# Altium schematic sheet IO.SchDoc
size C; SheetNumber: 7; SheetTotal: 7
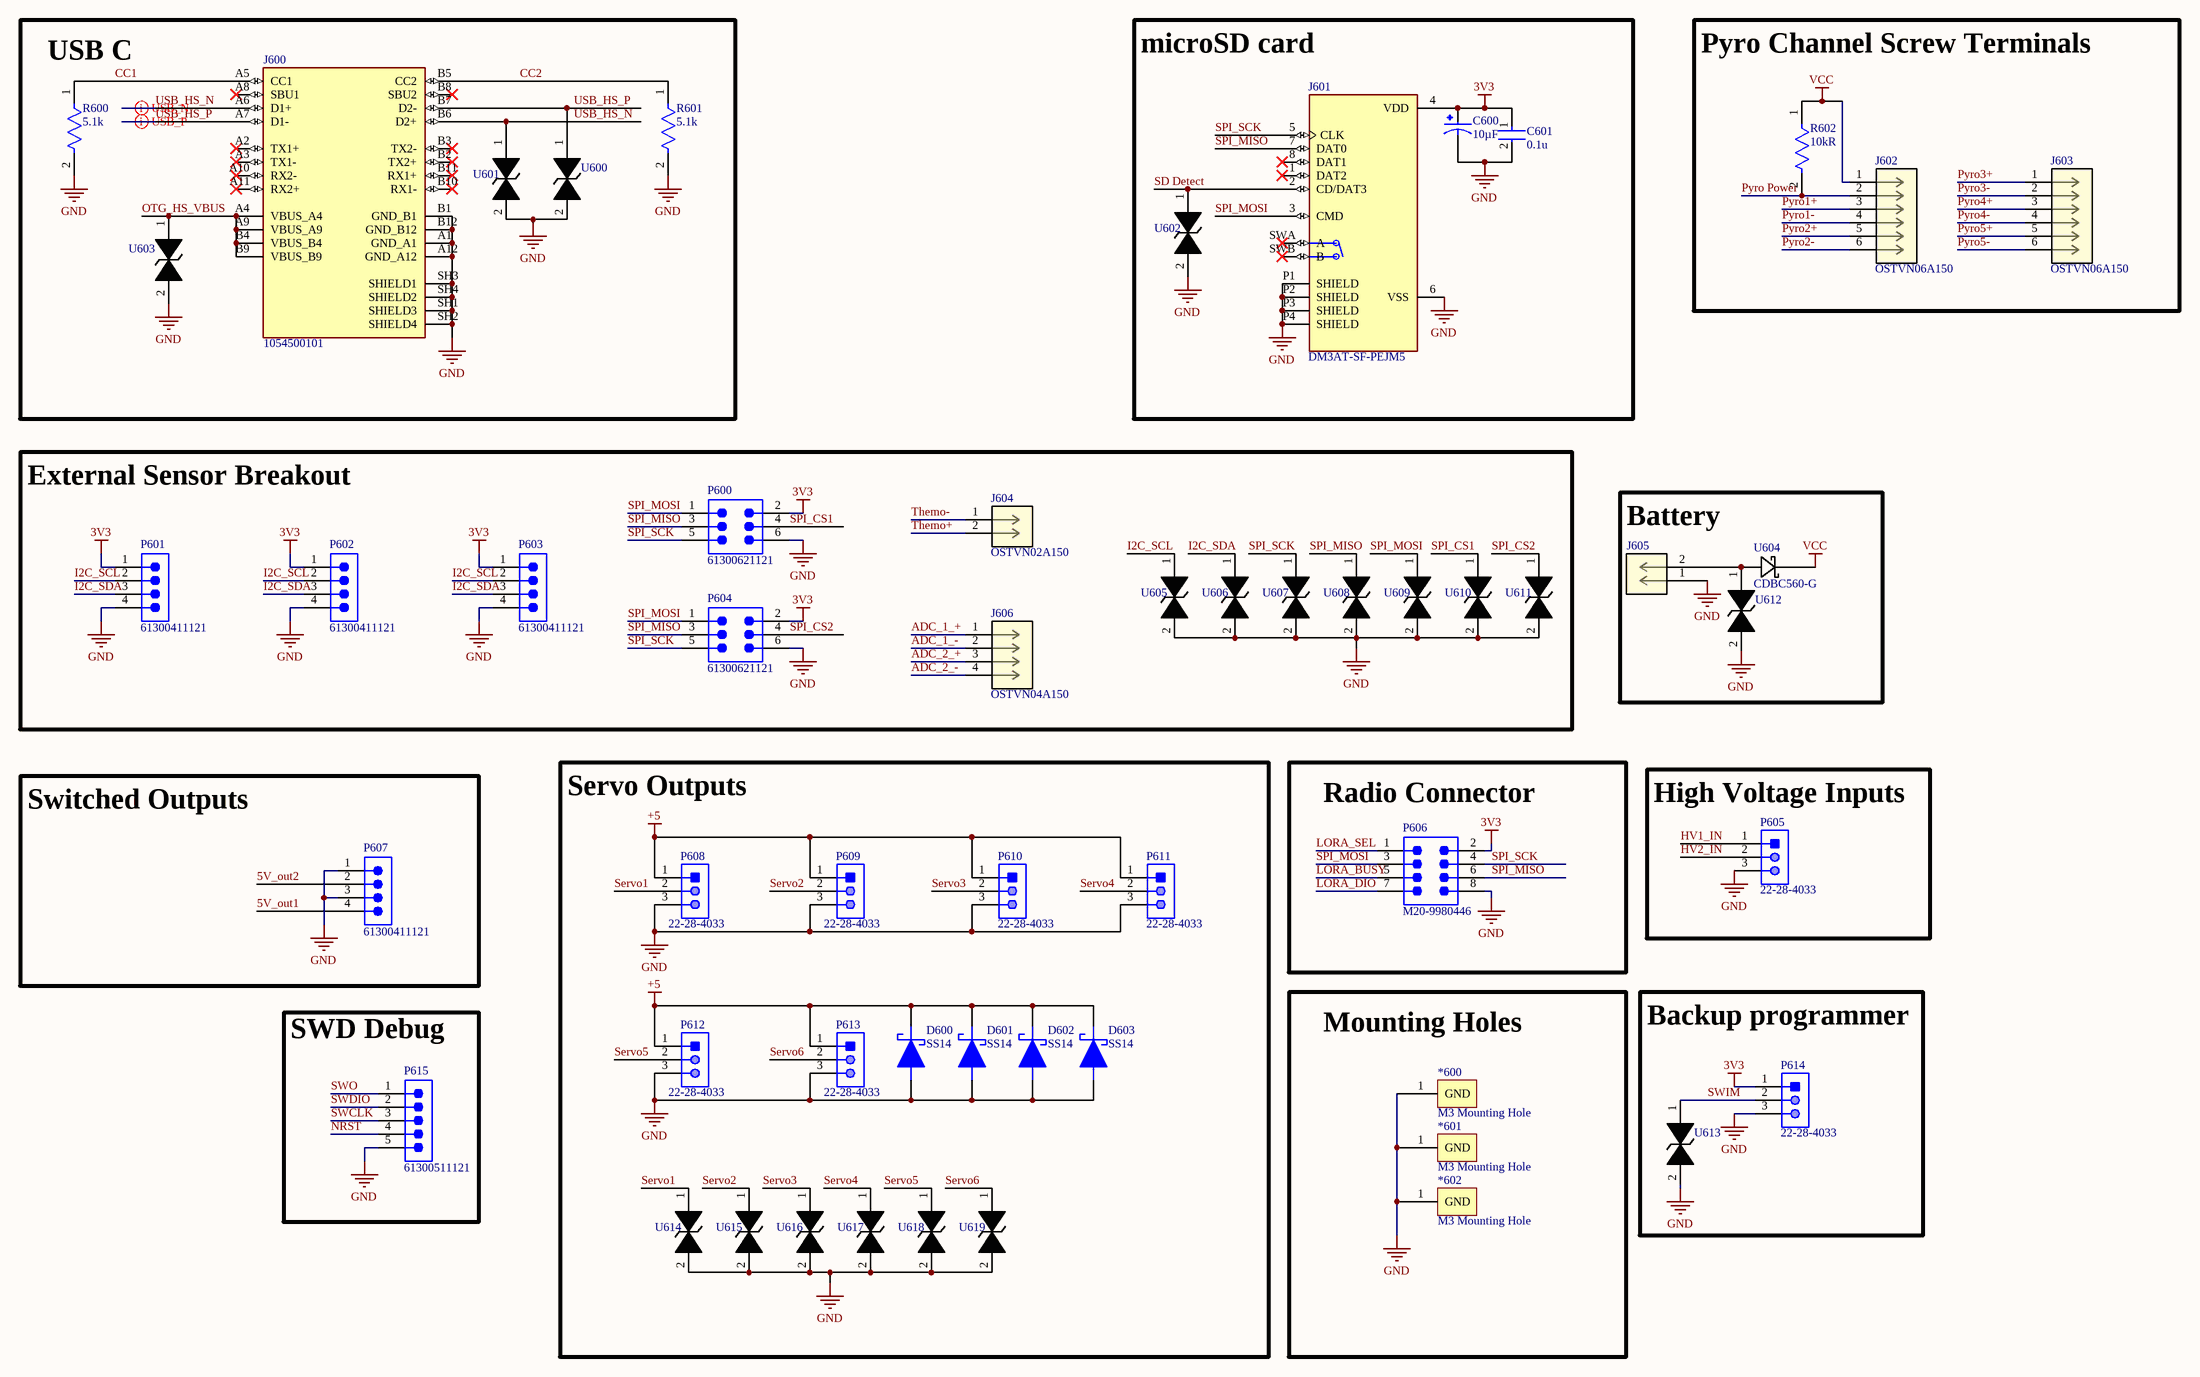
[diagram p0: IO.SchDoc]

## Parts
*600  M3 Mounting Hole  [M3 Mounting Hole-Footprint-1]
*601  M3 Mounting Hole  [M3 Mounting Hole-Footprint-1]
*602  M3 Mounting Hole  [M3 Mounting Hole-Footprint-1]
C600  value 10µF  [CAP_EEEFN1C100R]  (hidden comment: EEEFN1C100R)
C601  Capacitance: 0.1u  [FP-CL10-IPC_A]  (hidden comment: CL10C681JB8NFNC)
D600  SS14  [DIOM5227X270N]
D601  SS14  [DIOM5227X270N]
D602  SS14  [DIOM5227X270N]
D603  SS14  [DIOM5227X270N]
J600  1054500101  [MOLEX_1054500101]
J601  DM3AT-SF-PEJM5  [HRS_DM3AT-SF-PEJM5]
J602  OSTVN06A150  [CONN_OSTVN06A150_OST]
J603  OSTVN06A150  [CONN_OSTVN06A150_OST]
J604  OSTVN02A150  [CONN_OSTVN02A150_OST]
J605  OSTVN02A150  [CONN_OSTVN02A150_OST]  (value not drawn)
J606  OSTVN04A150  [CONN_OSTVN04A150_OST]
P600  61300621121  [61300621121]
P601  61300411121  [61300411121]
P602  61300411121  [61300411121]
P603  61300411121  [61300411121]
P604  61300621121  [61300621121]
P605  22-28-4033  [MOLX-22-28-4033_V]
P606  M20-9980446  [FP-M20-9980446-MFG]
P607  61300411121  [61300411121]
P608  22-28-4033  [MOLX-22-28-4033_V]
P609  22-28-4033  [MOLX-22-28-4033_V]
P610  22-28-4033  [MOLX-22-28-4033_V]
P611  22-28-4033  [MOLX-22-28-4033_V]
P612  22-28-4033  [MOLX-22-28-4033_V]
P613  22-28-4033  [MOLX-22-28-4033_V]
P614  22-28-4033  [MOLX-22-28-4033_V]
P615  61300511121  [61300511121]
R600  value 5.1k  [FP-CPF0603-MFG]  (hidden comment: CPF0603B2K15E1)
R601  value 5.1k  [FP-CPF0603-MFG]  (hidden comment: CPF0603B2K15E1)
R602  value 10kR  [FP-CPF0603-MFG]  (hidden comment: CPF0603B2K15E1)
U600  SP1003-01ETG  [SP1003-01ETG_LTF]  (value not drawn)
U601  SP1003-01ETG  [SP1003-01ETG_LTF]  (value not drawn)
U602  SP1003-01ETG  [SP1003-01ETG_LTF]  (value not drawn)
U603  SP1003-01ETG  [SP1003-01ETG_LTF]  (value not drawn)
U604  CDBC560-G  [CDBC-G]
U605  SP1003-01ETG  [SP1003-01ETG_LTF]  (value not drawn)
U606  SP1003-01ETG  [SP1003-01ETG_LTF]  (value not drawn)
U607  SP1003-01ETG  [SP1003-01ETG_LTF]  (value not drawn)
U608  SP1003-01ETG  [SP1003-01ETG_LTF]  (value not drawn)
U609  SP1003-01ETG  [SP1003-01ETG_LTF]  (value not drawn)
U610  SP1003-01ETG  [SP1003-01ETG_LTF]  (value not drawn)
U611  SP1003-01ETG  [SP1003-01ETG_LTF]  (value not drawn)
U612  SP1003-01ETG  [SP1003-01ETG_LTF]  (value not drawn)
U613  SP1003-01ETG  [SP1003-01ETG_LTF]  (value not drawn)
U614  SP1003-01ETG  [SP1003-01ETG_LTF]  (value not drawn)
U615  SP1003-01ETG  [SP1003-01ETG_LTF]  (value not drawn)
U616  SP1003-01ETG  [SP1003-01ETG_LTF]  (value not drawn)
U617  SP1003-01ETG  [SP1003-01ETG_LTF]  (value not drawn)
U618  SP1003-01ETG  [SP1003-01ETG_LTF]  (value not drawn)
U619  SP1003-01ETG  [SP1003-01ETG_LTF]  (value not drawn)

## Blocks framed on the sheet
USB C: J600 R600 R601 U600 U601 U603
microSD card: C600 C601 J601 U602
Pyro Channel Screw Terminals: J602 J603 R602
External Sensor Breakout: J604 J606 P600-P604 U605-U611
Battery: J605 U604 U612
Switched Outputs: P607
Servo Outputs: D600-D603 P608-P613 U614-U619
Radio Connector: P606
High Voltage Inputs: P605
Mounting Holes: *600-*602
Backup programmer: P614 U613
SWD Debug: P615

## Nets
3V3: C600.1 C601.1 J601.4(VDD) P600.2 P601.1 P602.1 P603.1 P604.2 P606.2 P614.1
+5: D600.1(K) D601.1(K) D602.1(K) D603.1(K) P608.1 P609.1 P610.1 P611.1 P612.1 P613.1
GND: *600.1(GND) *601.1(GND) *602.1(GND) C600.2 C601.2 D600.2(A) D601.2(A) D602.2(A) D603.2(A) J600.A1(GND_A1) J600.A12(GND_A12) J600.B1(GND_B1) J600.B12(GND_B12) J600.SH1(SHIELD3) J600.SH2(SHIELD4) J600.SH3(SHIELD1) J600.SH4(SHIELD2) J601.6(VSS) J601.P1(SHIELD) J601.P2(SHIELD) J601.P3(SHIELD) J601.P4(SHIELD) J605.1 P600.6 P601.4 P602.4 P603.4 P604.6 P605.3 P606.8 P607.1 P607.3 P608.3 P609.3 P610.3 P611.3 P612.3 P613.3 P614.3 P615.5 R600.2 R601.2 U600.2 U601.2 U602.2 U603.2 U605.2 U606.2 U607.2 U608.2 U609.2 U610.2 U611.2 U612.2 U613.2 U614.2 U615.2 U616.2 U617.2 U618.2 U619.2
VCC: J602.1 R602.1 U604.1
5V_out1: P607.4
5V_out2: P607.2
ADC_1_+: J606.1
ADC_1_-: J606.2
ADC_2_+: J606.3
ADC_2_-: J606.4
CC1: J600.A5(CC1) R600.1
CC2: J600.B5(CC2) R601.1
HV1_IN: P605.1
HV2_IN: P605.2
I2C_SCL: P601.2 P602.2 P603.2 U605.1
I2C_SDA: P601.3 P602.3 P603.3 U606.1
LORA_BUSY: P606.5
LORA_DIO: P606.7
LORA_SEL: P606.1
NRST: P615.4
OTG_HS_VBUS: J600.A4(VBUS_A4) J600.A9(VBUS_A9) J600.B4(VBUS_B4) J600.B9(VBUS_B9) U603.1
Pyro1+: J602.3
Pyro1-: J602.4
Pyro2+: J602.5
Pyro2-: J602.6
Pyro3+: J603.1
Pyro3-: J603.2
Pyro4+: J603.3
Pyro4-: J603.4
Pyro5+: J603.5
Pyro5-: J603.6
Pyro Power: J602.2 R602.2
SD Detect: J601.2(CD/DAT3) U602.1
Servo1: P608.2 U614.1
Servo2: P609.2 U615.1
Servo3: P610.2 U616.1
Servo4: P611.2 U617.1
Servo5: P612.2 U618.1
Servo6: P613.2 U619.1
SPI_CS1: P600.4 U610.1
SPI_CS2: P604.4 U611.1
SPI_MISO: J601.7(DAT0) P600.3 P604.3 P606.6 U608.1
SPI_MOSI: J601.3(CMD) P600.1 P604.1 P606.3 U609.1
SPI_SCK: J601.5(CLK) P600.5 P604.5 P606.4 U607.1
SWCLK: P615.3
SWDIO: P615.2
SWIM: P614.2 U613.1
SWO: P615.1
Themo+: J604.2
Themo-: J604.1
USB_HS_N: J600.A6(D1+) J600.B6(D2+) U601.1
USB_HS_P: J600.A7(D1-) J600.B7(D2-) U600.1
NetJ605_2: J605.2 U604.2 U612.1

Not connected (* = marked no-connect by the designer): J600 A2(TX1+)* A3(TX1-)* A8(SBU1)* A10(RX2-)* A11(RX2+)* B2(TX2+)* B3(TX2-)* B8(SBU2)* B10(RX1-)* B11(RX1+)*; J601 1(DAT2)* 8(DAT1)* SWA(A)* SWB(B)*

## Layout directives
differential pair: USB_HS_N, USB_HS_P

## Library data of the parts
*600-*602 = CMP-00028-00007-1: Pins: 1
C600 = CMP-001-00085-1: 10ÂµF 16V Aluminum Electrolytic Capacitors Radial, Can - SMD 1.35Ohm @ 100kHz 2000 Hrs @ 105Â°C; MF: Panasonic; Digi-Key_Part_Number: 10-EEE-FN1C100RCT-ND; Design Item ID: EEEFN1C100R; Check_prices: https://www.snapeda.com/parts/EEEFN1C100R/Panasonic/view-part/5793981/?ref=eda; MP: EEEFN1C100R; Source: EEEFN1C100R.SchLib; Case/Package: RADIAL-2 Panasonic; Component Type: Standard; Pins: 2; SnapEDA_Link: https://www.snapeda.com/parts/EEEFN1C100R/Panasonic/view-part/5793981/?ref=snap
C601 = CMP-13271-001533-1: Cap Ceramic 680pF 50V C0G ±5% Pad SMD 0603 +125°C T/R; Voltage Rating: 50V; Radiation Hardening: No; Length: 0.063inch; Min Operating Temperature: -55°C; Package Quantity: 1; Lead Free: Lead Free; Case Code (Metric): 1608; Thickness: 0.035inch; Width: 0.031inch; Height: 0.8mm; Case/Package: 0603; Tolerance: 5%; Mount: Surface Mount; Dielectric: C0G; Max Operating Temperature: 125°C; Case Code (Imperial): 0603; Packaging: Tape and Reel; Depth: 0.8mm
D600-D603 = CMP-004-00031-2: Diode Schottky 40 V 1A Surface Mount DO-214AC (SMA); MF: ON Semiconductor; Pins: 2; Design Item ID: SS14; Value: *; Component Type: Standard; Case/Package: SMA-2 ON Semiconductor; MP: SS14; Check_prices: https://www.snapeda.com/parts/SS14/Onsemi/view-part/?ref=eda; SnapEDA_Link: https://www.snapeda.com/parts/SS14/Onsemi/view-part/?ref=snap; Source: SS14.SchLib
J600 = CMP-002-00073-1: USB-C (USB TYPE-C) USB 3.2 Gen 2 (USB 3.1 Gen 2, Superspeed + (USB 3.1)) Receptacle Connector 24 Position Surface Mount, Right Angle; Through Hole; MF: Molex; Source: 1054500101.SchLib; Design Item ID: 1054500101; Pins: 28; SnapEDA_Link: https://www.snapeda.com/parts/1054500101/Molex/view-part/?ref=snap; Value: *; Check_prices: https://www.snapeda.com/parts/1054500101/Molex/view-part/?ref=eda; Component Type: Standard; MP: 1054500101; Case/Package: None
J601 = CMP-002-00075-1: 10 (8 + 2) Position Card Connector Secure Digital - microSDâ„¢ Surface Mount, Right Angle Gold; MF: Hirose; Design Item ID: DM3AT-SF-PEJM5; Check_prices: https://www.snapeda.com/parts/DM3AT-SF-PEJM5/Hirose+Electric+Co+Ltd/view-part/?ref=eda; SnapEDA_Link: https://www.snapeda.com/parts/DM3AT-SF-PEJM5/Hirose+Electric+Co+Ltd/view-part/?ref=snap; Component Type: Standard; Case/Package: None; Source: DM3AT-SF-PEJM5.SchLib; Value: *; MP: DM3AT-SF-PEJM5; Pins: 14
J602 J603 = CMP-039-000000-1: No Description Available; Mfr_Name: On Shore Technology; RefDes: RefDes; Design Item ID: OSTVN06A150; Source: OSTVN06A150.SchLib; Type: Type
J604 J605 = CMP-032-000000-1: No Description Available; Mfr_Name: On Shore Technology; RefDes: RefDes; Type: Type; Design Item ID: OSTVN02A150; Source: OSTVN02A150.SchLib
J606 = CMP-035-000000-1: No Description Available; Mfr_Name: On Shore Technology; Design Item ID: OSTVN04A150; Type: Type; RefDes: RefDes; Source: OSTVN04A150.SchLib
P600 P604 = CMP-1502-01072-3: NexarPartId: 32855529; Row Spacing: 2.54mm; Current Rating: 3A; Voltage Rating: 250V; Contact Resistance: 20mΩ; Connector Type: Male Pin; Number of Positions: 6; Gender: Male; Termination: Solder; Orientation: Vertical; Max Operating Temperature: 105°C; Contact Plating: Gold; Height: 8.89mm; Contact Mating Length: 5.9944mm; Mount: Through Hole; Min Operating Temperature: -40°C; Lead Pitch: 2.54mm; Number of Pins: 6; Operating Supply Voltage: 250V; Color: Black; Pitch: 2.54mm; Packaging: Bulk; Contact Material: Copper; REACH SVHC: Unknown; RoHS: Compliant; Number of Rows: 2; Number of Contacts: 6
P601-P603 P607 = CMP-1502-01064-3: NexarPartId: 32855522; Operating Supply Voltage: 250V; Pitch: 2.54mm; Contact Resistance: 20mΩ; Number of Positions: 4; Current Rating: 3A; Connector Type: Male Pin; Gender: Male; Contact Plating: Gold; Height: 8.89mm; Lead Pitch: 2.54mm; Lead Free: Lead Free; Contact Mating Length: 5.9944mm; Number of Rows: 1; Termination: Solder; Packaging: Bulk; REACH SVHC: Unknown; Min Operating Temperature: -40°C; RoHS: Compliant; Number of Contacts: 4; Voltage Rating: 250V; Color: Black; Max Operating Temperature: 105°C; Contact Material: Copper; Mount: Through Hole; Orientation: Vertical; Number of Pins: 4
P605 P608-P614 = CMP-1676-00001-5: Male Header, Pitch 2.54 mm, 1 x 3 Position, Height 8.38 mm, Tail Length 3.18 mm, RoHS, Bulk; Manufacturer: Molex; Rows: 1; Voltage Rating: 250 V; Current Rating: 4 A; Min Operating Temperature: 0 degC; Lead Pitch: 0.1 inch; Packaging: Bulk; Contact Finish: Gold; RoHSCompliant: true; Contact Material: Brass; PackageReference: 22-28-4033; REACH SVHC: Unknown; PackageDescription: Male Header, Pitch 2.54 mm, 1 x 3 Position, Height 8.38 mm, Tail Length 3.18 mm; ComponentLink2URL: http://www.molex.com/pdm_docs/sd/022284033_sd.pdf; Height: 8.38 mm; Mounting Technology: Through Hole; ComponentLink1Description: Manufacturer URL; Length: 7.62 mm; Mount: Through Hole; DatasheetVersion: Rev. G, 01/2012; Max Operating Temperature: 75 degC; ComponentLink2Description: Datasheet; Colour: Black; Pins: 3; Contact Plating: Gold; Package Quantity: 1; ComponentLink1URL: http://www.molex.com/
P606 = CMP-002-00074-1: Board Connector, 8 Contact(s), 1 Row(s), Male, Straight, 0.1 inch Pitch, Solder Terminal, Locking, Black Insulator, Receptacle; Max Operating Temperature: 105°C; Connector Type: BOARD CONNECTOR; Mounting Technology: Board; RoHS Compliant: Yes; Min Operating Temperature: -40°C
P615 = CMP-1502-01068-3: NexarPartId: 32855526; Connector Type: Male Pin; Gender: Male; Contact Resistance: 20mΩ; Pitch: 2.54mm; Operating Supply Voltage: 250V; Current Rating: 3A; Number of Contacts: 5; Lead Free: Lead Free; Color: Black; Packaging: Bulk; Lead Pitch: 2.54mm; Contact Material: Copper; Min Operating Temperature: -40°C; Contact Mating Length: 5.9944mm; Voltage Rating: 250V; Number of Pins: 5; Number of Positions: 5; Height: 8.89mm; Orientation: Vertical; REACH SVHC: Unknown; RoHS: Compliant; Contact Plating: Gold; Max Operating Temperature: 105°C; Mount: Through Hole; Number of Rows: 1; Termination: Solder
R600-R602 = CMP-03211-008657-1: RES SMD 2.15KΩ 0.1% 1/16W 0603; Manufacturer: TE Connectivity; Temperature Coefficient: 25ppm/°C; Voltage Rating: 50V; Power Rating: 0.063W; Height: 0.55mm; Series: CPF; ComponentLink2Description: Datasheet; Package: CPF0603; Automotive: No; octopart_url: https://octopart.com/cpf0603b2k15e1-te+connectivity-22739551; Lead Free: Yes; Temperature: -55°C to +155°C; RoHS: TRUE; Ipc Land Pattern Name: RESC15580X45; Temperature Range Low: -55°C; Composition: Thin Film; Device Class L3: Chip SMD Resistors; Category: Res; Octopart: https://octopart.com/cpf0603b2k15e1-te+connectivity-22739551; Resistance: 2.15KΩ; ComponentLink2URL: https://www.te.com/commerce/DocumentDelivery/DDEController?Action=showdoc&DocId=Data+Sheet%7F1773200%7FM%7Fpdf%7FEnglish%7FENG_DS_1773200_M.pdf%7F3-1676481-2; Manufacturer Part Number: CPF0603B2K15E1; packaging: 1k Reel; Tolerance: 0.1%; Temperature Range High: +155°C; Device Class L1: Passive Components; Device Class L2: Resistors
U600-U603 U605-U619 = CMP-104-000000-3: No Description Available; Mfr_Name: Littelfuse Inc; Source: SP1003-01ETG.SchLib; Design Item ID: SP1003-01ETG; Type: Type; RefDes: RefDes
U604 = CMP-137-000000-2: No Description Available; Mfr_Name: Comchip; Design Item ID: CDBC560-G; Source: CDBC560-G.SchLib